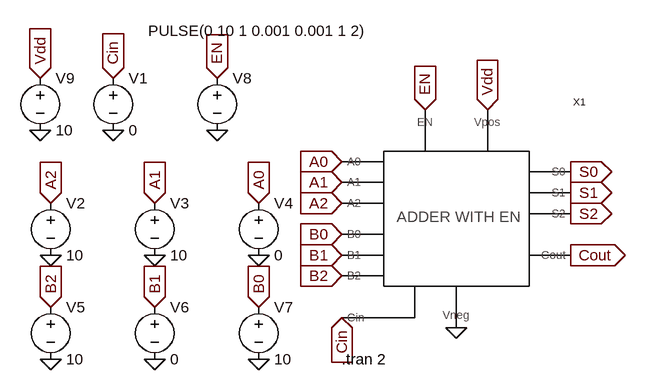
[diagram p0: schematic ADDER_EN_TESTING.asc]
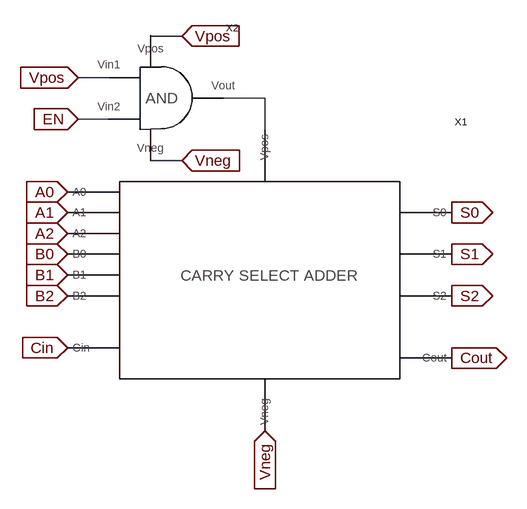
[diagram p1: sub-circuit adder_en_sym.asc]
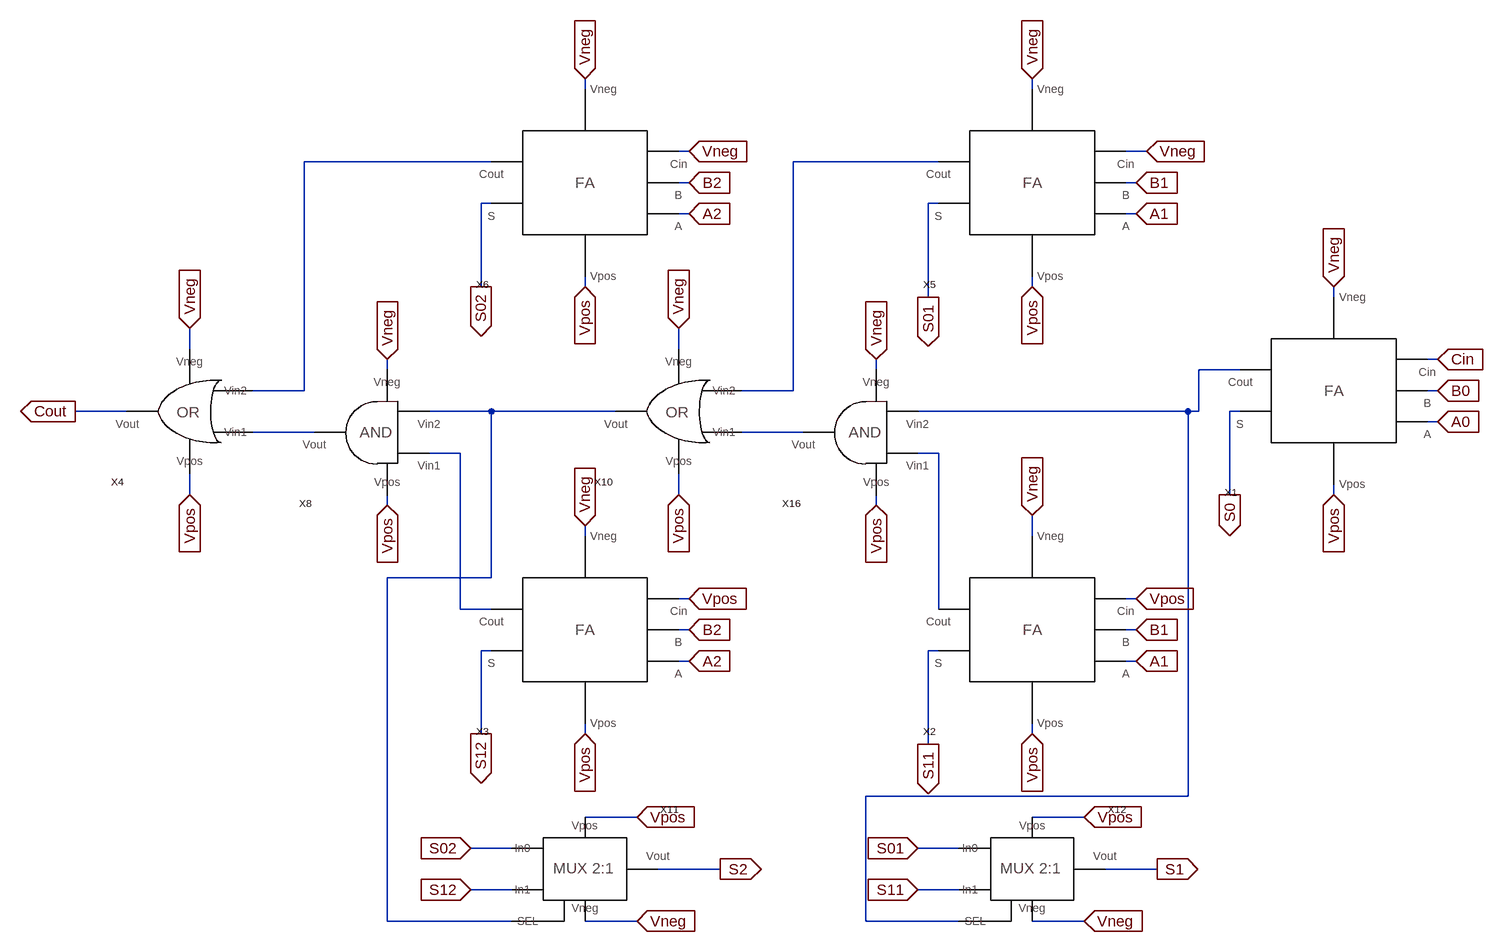
[diagram p2: sub-circuit carry_select_adder_sym.asc]
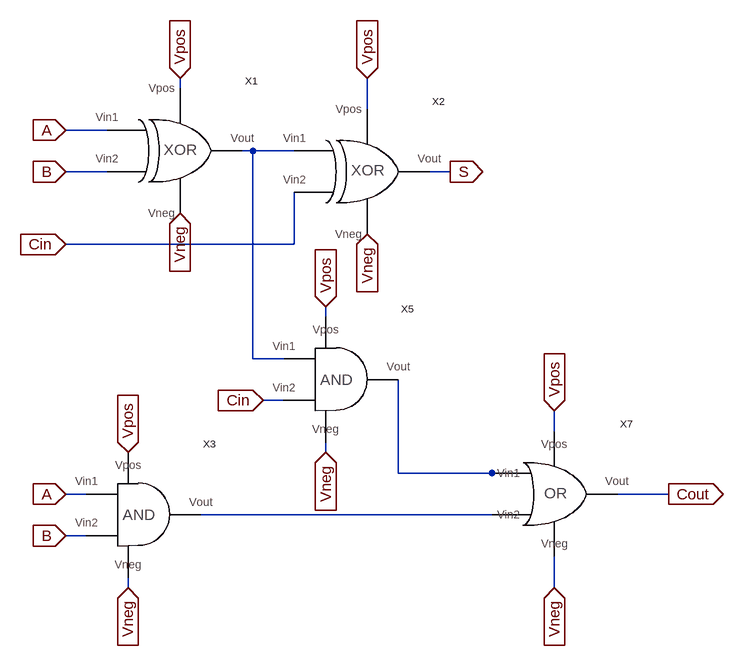
[diagram p3: sub-circuit full_adder_sym.asc]
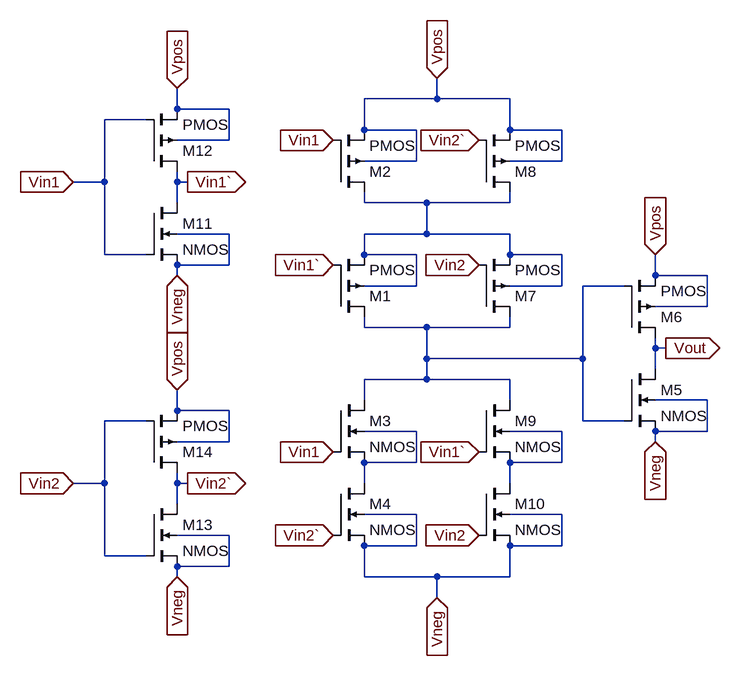
[diagram p4: sub-circuit xor_sym.asc]
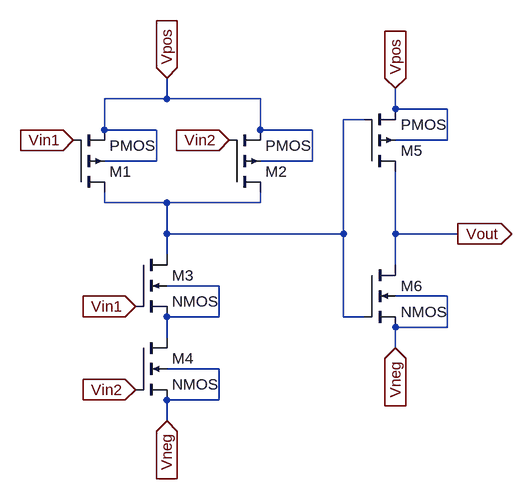
[diagram p5: sub-circuit and_sym.asc]
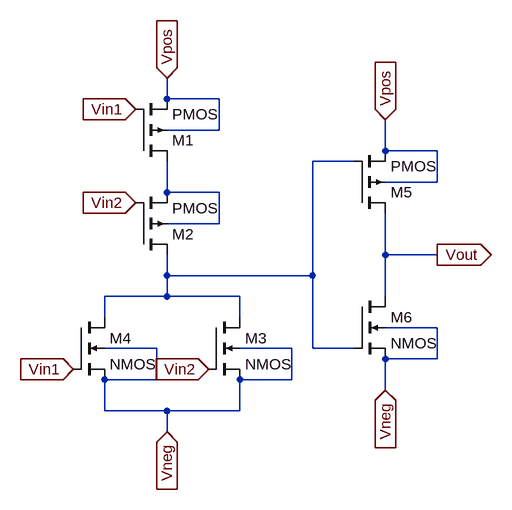
[diagram p6: sub-circuit or_sym.asc]
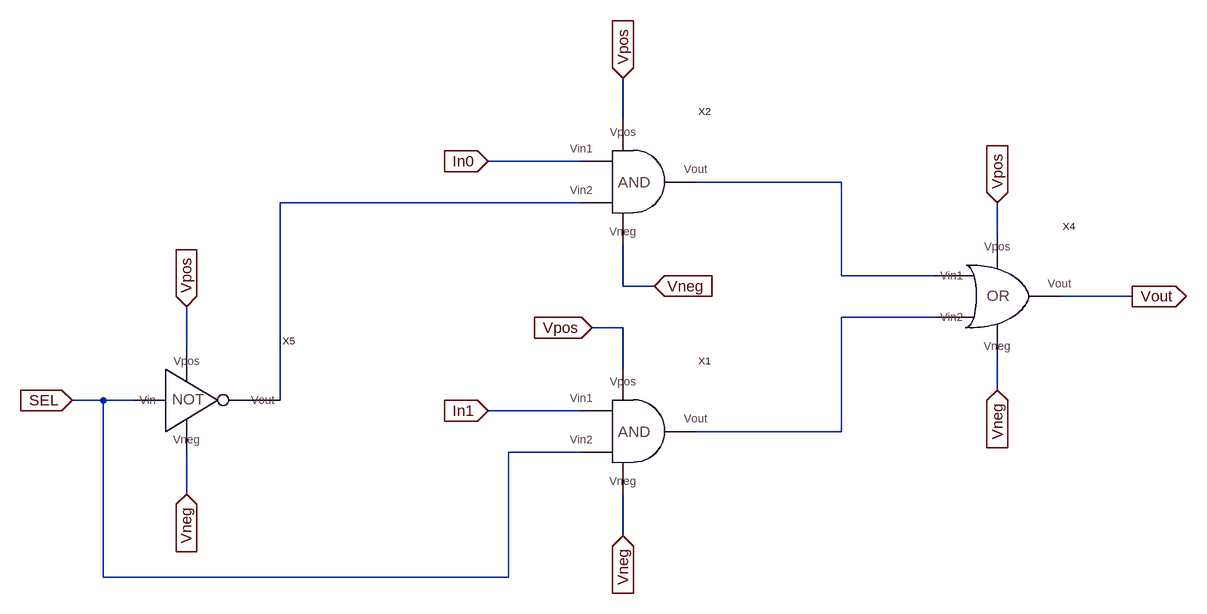
[diagram p7: sub-circuit mux2_1.asc]
ADDER_EN_TESTING.asc, the LTspice schematic file:
Version 4
SHEET 1 880 680
FLAG 160 96 A0
IOPIN 160 96 In
FLAG 160 128 A1
IOPIN 160 128 In
FLAG 160 160 A2
IOPIN 160 160 In
FLAG 160 208 B0
IOPIN 160 208 In
FLAG 160 240 B1
IOPIN 160 240 In
FLAG 160 272 B2
IOPIN 160 272 In
FLAG 288 16 EN
IOPIN 288 16 In
FLAG 384 16 Vdd
IOPIN 384 16 In
FLAG 336 352 0
FLAG -192 48 0
FLAG -32 48 0
FLAG -288 240 0
FLAG -128 240 0
FLAG 32 240 0
FLAG -288 400 0
FLAG -128 400 0
FLAG 32 400 0
FLAG -192 -32 Cin
IOPIN -192 -32 In
FLAG -32 -32 EN
IOPIN -32 -32 In
FLAG 32 160 A0
IOPIN 32 160 In
FLAG -128 160 A1
IOPIN -128 160 In
FLAG -288 160 A2
IOPIN -288 160 In
FLAG 32 320 B0
IOPIN 32 320 In
FLAG -128 320 B1
IOPIN -128 320 In
FLAG -288 320 B2
IOPIN -288 320 In
FLAG 512 112 S0
IOPIN 512 112 Out
FLAG 512 144 S1
IOPIN 512 144 Out
FLAG 512 176 S2
IOPIN 512 176 Out
FLAG 512 240 Cout
IOPIN 512 240 Out
FLAG -304 48 0
FLAG -304 -32 Vdd
IOPIN -304 -32 In
FLAG 160 336 Cin
IOPIN 160 336 In
SYMBOL ADDER_EN_SYM 336 176 R0
SYMATTR InstName X1
SYMBOL voltage -192 -48 R0
WINDOW 123 0 0 Left 0
WINDOW 39 0 0 Left 0
SYMATTR InstName V1
SYMATTR Value 0
SYMBOL voltage -288 144 R0
WINDOW 123 0 0 Left 0
WINDOW 39 0 0 Left 0
SYMATTR InstName V2
SYMATTR Value 10
SYMBOL voltage -128 144 R0
WINDOW 123 0 0 Left 0
WINDOW 39 0 0 Left 0
SYMATTR InstName V3
SYMATTR Value 10
SYMBOL voltage 32 144 R0
WINDOW 123 0 0 Left 0
WINDOW 39 0 0 Left 0
SYMATTR InstName V4
SYMATTR Value 0
SYMBOL voltage -288 304 R0
WINDOW 123 0 0 Left 0
WINDOW 39 0 0 Left 0
SYMATTR InstName V5
SYMATTR Value 10
SYMBOL voltage -128 304 R0
WINDOW 123 0 0 Left 0
WINDOW 39 0 0 Left 0
SYMATTR InstName V6
SYMATTR Value 0
SYMBOL voltage 32 304 R0
WINDOW 123 0 0 Left 0
WINDOW 39 0 0 Left 0
SYMATTR InstName V7
SYMATTR Value 10
SYMBOL voltage -32 -48 R0
WINDOW 3 -106 -57 Left 2
WINDOW 123 0 0 Left 0
WINDOW 39 0 0 Left 0
SYMATTR Value PULSE(0 10 1 0.001 0.001 1 2)
SYMATTR InstName V8
SYMBOL voltage -304 -48 R0
WINDOW 123 0 0 Left 0
WINDOW 39 0 0 Left 0
SYMATTR InstName V9
SYMATTR Value 10
TEXT 160 400 Left 2 !.tran 2

adder_en_sym.asc, the sub-circuit schematic file:
Version 4
SHEET 1 880 680
WIRE 112 -160 64 -160
WIRE 0 -96 -48 -96
WIRE 240 -64 176 -64
WIRE 0 -32 -48 -32
WIRE 240 -16 240 -64
WIRE 112 32 64 32
FLAG -64 80 A0
IOPIN -64 80 In
FLAG -64 112 A1
IOPIN -64 112 In
FLAG -64 144 A2
IOPIN -64 144 In
FLAG -64 176 B0
IOPIN -64 176 In
FLAG -64 208 B1
IOPIN -64 208 In
FLAG -64 240 B2
IOPIN -64 240 In
FLAG 240 448 Vneg
IOPIN 240 448 In
FLAG 528 112 S0
IOPIN 528 112 Out
FLAG 528 176 S1
IOPIN 528 176 Out
FLAG 528 240 S2
IOPIN 528 240 Out
FLAG 528 336 Cout
IOPIN 528 336 Out
FLAG -48 -96 Vpos
IOPIN -48 -96 In
FLAG -48 -32 EN
IOPIN -48 -32 In
FLAG 112 -160 Vpos
IOPIN 112 -160 In
FLAG 112 32 Vneg
IOPIN 112 32 In
FLAG -64 320 Cin
IOPIN -64 320 In
SYMBOL CARRY_SELECT_ADDER_SYM 240 208 R0
SYMATTR InstName X1
SYMBOL AND_SYM 80 -64 R0
SYMATTR InstName X2

carry_select_adder_sym.asc, the sub-circuit schematic file:
Version 4
SHEET 1 1472 884
WIRE -400 -688 -400 -704
WIRE 288 -688 288 -704
WIRE -240 -592 -256 -592
WIRE 464 -592 432 -592
WIRE -544 -576 -832 -576
WIRE 144 -576 -80 -576
WIRE -240 -544 -256 -544
WIRE 448 -544 432 -544
WIRE -544 -512 -560 -512
WIRE 144 -512 128 -512
WIRE -240 -496 -256 -496
WIRE 448 -496 432 -496
WIRE -560 -384 -560 -512
WIRE -400 -384 -400 -400
WIRE 288 -384 288 -400
WIRE 128 -368 128 -512
WIRE 752 -368 752 -384
WIRE -1008 -288 -1008 -320
WIRE -256 -288 -256 -320
WIRE 912 -272 896 -272
WIRE -704 -256 -704 -272
WIRE 48 -256 48 -272
WIRE 608 -256 544 -256
WIRE -832 -224 -832 -576
WIRE -832 -224 -912 -224
WIRE -80 -224 -80 -576
WIRE -80 -224 -160 -224
WIRE 912 -224 896 -224
WIRE -1104 -192 -1184 -192
WIRE -544 -192 -640 -192
WIRE -352 -192 -544 -192
WIRE 528 -192 112 -192
WIRE 544 -192 544 -256
WIRE 544 -192 528 -192
WIRE 608 -192 592 -192
WIRE 912 -176 896 -176
WIRE -816 -160 -912 -160
WIRE -64 -160 -160 -160
WIRE -592 -128 -640 -128
WIRE 144 -128 112 -128
WIRE -1008 -64 -1008 -96
WIRE -256 -64 -256 -96
WIRE 592 -64 592 -192
WIRE 752 -64 752 -80
WIRE -704 -48 -704 -64
WIRE 48 -48 48 -64
WIRE -400 0 -400 -16
WIRE 288 0 288 -32
WIRE -544 64 -544 -192
WIRE -544 64 -704 64
WIRE -240 96 -256 96
WIRE 448 96 432 96
WIRE -592 112 -592 -128
WIRE -544 112 -592 112
WIRE 144 112 144 -128
WIRE -240 144 -256 144
WIRE 448 144 432 144
WIRE -544 176 -560 176
WIRE 144 176 128 176
WIRE -240 192 -256 192
WIRE 448 192 432 192
WIRE -560 304 -560 176
WIRE -400 304 -400 288
WIRE 288 304 288 288
WIRE 128 320 128 176
WIRE 528 400 528 -192
WIRE 528 400 32 400
WIRE -320 432 -400 432
WIRE 368 432 288 432
WIRE -512 480 -576 480
WIRE 176 480 112 480
WIRE -192 512 -288 512
WIRE 480 512 400 512
WIRE -512 544 -576 544
WIRE 176 544 112 544
WIRE -704 592 -704 64
WIRE -512 592 -704 592
WIRE -320 592 -400 592
WIRE 32 592 32 400
WIRE 176 592 32 592
WIRE 368 592 288 592
FLAG 912 -176 A0
IOPIN 912 -176 In
FLAG 448 192 A1
IOPIN 448 192 In
FLAG -240 192 A2
IOPIN -240 192 In
FLAG 912 -224 B0
IOPIN 912 -224 In
FLAG 448 144 B1
IOPIN 448 144 In
FLAG -240 144 B2
IOPIN -240 144 In
FLAG -400 304 Vpos
IOPIN -400 304 In
FLAG 288 304 Vpos
IOPIN 288 304 In
FLAG 752 -64 Vpos
IOPIN 752 -64 In
FLAG 592 -64 S0
IOPIN 592 -64 Out
FLAG 128 320 S11
IOPIN 128 320 Out
FLAG -560 304 S12
IOPIN -560 304 Out
FLAG 448 -496 A1
IOPIN 448 -496 In
FLAG -240 -496 A2
IOPIN -240 -496 In
FLAG 448 -544 B1
IOPIN 448 -544 In
FLAG -240 -544 B2
IOPIN -240 -544 In
FLAG 288 -384 Vpos
IOPIN 288 -384 In
FLAG 288 -704 Vneg
IOPIN 288 -704 In
FLAG -400 -704 Vneg
IOPIN -400 -704 In
FLAG 128 -368 S01
IOPIN 128 -368 Out
FLAG -560 -384 S02
IOPIN -560 -384 Out
FLAG -400 -384 Vpos
IOPIN -400 -384 In
FLAG 752 -384 Vneg
IOPIN 752 -384 In
FLAG 288 -32 Vneg
IOPIN 288 -32 In
FLAG -400 -16 Vneg
IOPIN -400 -16 In
FLAG -1008 -64 Vpos
IOPIN -1008 -64 In
FLAG -1008 -320 Vneg
IOPIN -1008 -320 In
FLAG -704 -48 Vpos
IOPIN -704 -48 In
FLAG -704 -272 Vneg
IOPIN -704 -272 In
FLAG -256 -320 Vneg
IOPIN -256 -320 In
FLAG 48 -272 Vneg
IOPIN 48 -272 In
FLAG -256 -64 Vpos
IOPIN -256 -64 In
FLAG 48 -48 Vpos
IOPIN 48 -48 In
FLAG -320 432 Vpos
IOPIN -320 432 In
FLAG 368 432 Vpos
IOPIN 368 432 In
FLAG -320 592 Vneg
IOPIN -320 592 In
FLAG 368 592 Vneg
IOPIN 368 592 In
FLAG -576 480 S02
IOPIN -576 480 In
FLAG -576 544 S12
IOPIN -576 544 In
FLAG 112 480 S01
IOPIN 112 480 In
FLAG 112 544 S11
IOPIN 112 544 In
FLAG -192 512 S2
IOPIN -192 512 Out
FLAG 480 512 S1
IOPIN 480 512 Out
FLAG -1184 -192 Cout
IOPIN -1184 -192 Out
FLAG 464 -592 Vneg
IOPIN 464 -592 In
FLAG -240 -592 Vneg
IOPIN -240 -592 In
FLAG -240 96 Vpos
IOPIN -240 96 In
FLAG 448 96 Vpos
IOPIN 448 96 In
FLAG 912 -272 Cin
IOPIN 912 -272 In
SYMBOL FULL_ADDER_SYM 752 -224 R180
SYMATTR InstName X1
SYMBOL FULL_ADDER_SYM 288 144 R180
SYMATTR InstName X2
SYMBOL FULL_ADDER_SYM -400 144 R180
SYMATTR InstName X3
SYMBOL FULL_ADDER_SYM 288 -544 R180
SYMATTR InstName X5
SYMBOL FULL_ADDER_SYM -400 -544 R180
SYMATTR InstName X6
SYMBOL OR_SYM -272 -192 R180
SYMATTR InstName X10
SYMBOL MUX2_1 -400 512 R0
SYMATTR InstName X11
SYMBOL MUX2_1 288 512 R0
SYMATTR InstName X12
SYMBOL AND_SYM 32 -160 R180
SYMATTR InstName X16
SYMBOL OR_SYM -1024 -192 R180
SYMATTR InstName X4
SYMBOL AND_SYM -720 -160 R180
SYMATTR InstName X8

full_adder_sym.asc, the sub-circuit schematic file:
Version 4
SHEET 1 1280 1092
WIRE 256 48 256 32
WIRE 544 80 544 32
WIRE 144 112 80 112
WIRE 368 144 352 144
WIRE 432 144 368 144
WIRE 144 176 80 176
WIRE 672 176 640 176
WIRE 432 288 432 208
WIRE 432 288 80 288
WIRE 480 400 480 384
WIRE 368 464 368 144
WIRE 416 464 368 464
WIRE 416 528 384 528
WIRE 832 576 832 544
WIRE 480 608 480 592
WIRE 176 624 176 608
WIRE 592 640 592 496
WIRE 736 640 592 640
WIRE 752 640 736 640
WIRE 112 672 80 672
WIRE 1008 672 928 672
WIRE 736 704 288 704
WIRE 112 736 80 736
WIRE 176 816 176 800
WIRE 832 816 832 768
FLAG 80 112 A
IOPIN 80 112 In
FLAG 80 176 B
IOPIN 80 176 In
FLAG 80 288 Cin
IOPIN 80 288 In
FLAG 256 32 Vpos
IOPIN 256 32 In
FLAG 256 240 Vneg
IOPIN 256 240 In
FLAG 544 32 Vpos
IOPIN 544 32 In
FLAG 544 272 Vneg
IOPIN 544 272 In
FLAG 80 672 A
IOPIN 80 672 In
FLAG 80 736 B
IOPIN 80 736 In
FLAG 384 528 Cin
IOPIN 384 528 In
FLAG 176 608 Vpos
IOPIN 176 608 In
FLAG 480 384 Vpos
IOPIN 480 384 In
FLAG 832 544 Vpos
IOPIN 832 544 In
FLAG 672 176 S
IOPIN 672 176 Out
FLAG 1008 672 Cout
IOPIN 1008 672 Out
FLAG 176 816 Vneg
IOPIN 176 816 In
FLAG 480 608 Vneg
IOPIN 480 608 In
FLAG 832 816 Vneg
IOPIN 832 816 In
SYMBOL XOR_SYM 256 144 R0
SYMATTR InstName X1
SYMBOL XOR_SYM 544 176 R0
SYMATTR InstName X2
SYMBOL AND_SYM 192 704 R0
SYMATTR InstName X3
SYMBOL AND_SYM 496 496 R0
SYMATTR InstName X5
SYMBOL OR_SYM 848 672 R0
SYMATTR InstName X7

xor_sym.asc, the sub-circuit schematic file:
Version 4
SHEET 1 880 772
WIRE 144 -144 144 -176
WIRE 144 -144 32 -144
WIRE 256 -144 144 -144
WIRE -256 -128 -256 -160
WIRE -176 -128 -256 -128
WIRE -304 -112 -368 -112
WIRE 32 -96 32 -144
WIRE 112 -96 32 -96
WIRE 256 -96 256 -144
WIRE 336 -96 256 -96
WIRE -176 -80 -176 -128
WIRE -176 -80 -256 -80
WIRE 112 -48 112 -96
WIRE 112 -48 32 -48
WIRE 336 -48 336 -96
WIRE 336 -48 256 -48
WIRE -368 -16 -368 -112
WIRE -368 -16 -416 -16
WIRE -256 -16 -256 -32
WIRE -240 -16 -256 -16
WIRE -256 16 -256 -16
WIRE 32 16 32 0
WIRE 128 16 32 16
WIRE 256 16 256 0
WIRE 256 16 128 16
WIRE -176 64 -256 64
WIRE 128 64 128 16
WIRE 128 64 32 64
WIRE 256 64 128 64
WIRE -368 96 -368 -16
WIRE -304 96 -368 96
WIRE 32 96 32 64
WIRE 112 96 32 96
WIRE 256 96 256 64
WIRE 336 96 256 96
WIRE -176 112 -176 64
WIRE -176 112 -256 112
WIRE -256 128 -256 112
WIRE 480 128 480 96
WIRE 560 128 480 128
WIRE 112 144 112 96
WIRE 112 144 32 144
WIRE 336 144 336 96
WIRE 336 144 256 144
WIRE 432 144 368 144
WIRE 560 176 560 128
WIRE 560 176 480 176
WIRE 32 208 32 192
WIRE 128 208 32 208
WIRE 256 208 256 192
WIRE 256 208 128 208
WIRE 480 240 480 224
WIRE 496 240 480 240
WIRE 128 256 128 208
WIRE 368 256 368 144
WIRE 368 256 128 256
WIRE 480 272 480 240
WIRE 128 288 128 256
WIRE 128 288 32 288
WIRE 256 288 128 288
WIRE 32 320 32 288
WIRE 256 320 256 288
WIRE 560 320 480 320
WIRE -256 336 -256 304
WIRE -176 336 -256 336
WIRE -304 352 -368 352
WIRE 368 352 368 256
WIRE 432 352 368 352
WIRE 112 368 32 368
WIRE 336 368 256 368
WIRE 560 368 560 320
WIRE 560 368 480 368
WIRE -176 384 -176 336
WIRE -176 384 -256 384
WIRE 480 384 480 368
WIRE 112 416 112 368
WIRE 112 416 32 416
WIRE 336 416 336 368
WIRE 336 416 256 416
WIRE -368 448 -368 352
WIRE -368 448 -416 448
WIRE -256 448 -256 432
WIRE -240 448 -256 448
WIRE 32 448 32 416
WIRE 256 448 256 416
WIRE -256 480 -256 448
WIRE 112 496 32 496
WIRE 336 496 256 496
WIRE -176 528 -256 528
WIRE 112 544 112 496
WIRE 112 544 32 544
WIRE 336 544 336 496
WIRE 336 544 256 544
WIRE -368 560 -368 448
WIRE -304 560 -368 560
WIRE -176 576 -176 528
WIRE -176 576 -256 576
WIRE -256 592 -256 576
WIRE 32 592 32 544
WIRE 144 592 32 592
WIRE 256 592 256 544
WIRE 256 592 144 592
WIRE 144 624 144 592
FLAG 144 -176 Vpos
IOPIN 144 -176 In
FLAG -416 -16 Vin1
IOPIN -416 -16 In
FLAG -16 400 Vin1
IOPIN -16 400 In
FLAG -416 448 Vin2
IOPIN -416 448 In
FLAG 144 624 Vneg
IOPIN 144 624 In
FLAG 480 96 Vpos
IOPIN 480 96 In
FLAG 480 384 Vneg
IOPIN 480 384 In
FLAG 496 240 Vout
IOPIN 496 240 Out
FLAG -16 -80 Vin1
IOPIN -16 -80 In
FLAG -256 -160 Vpos
IOPIN -256 -160 In
FLAG -256 128 Vneg
IOPIN -256 128 In
FLAG -240 -16 Vin1`
IOPIN -240 -16 Out
FLAG -256 304 Vpos
IOPIN -256 304 In
FLAG -256 592 Vneg
IOPIN -256 592 In
FLAG -240 448 Vin2`
IOPIN -240 448 Out
FLAG 208 112 Vin2
IOPIN 208 112 In
FLAG 208 -80 Vin2`
IOPIN 208 -80 In
FLAG -16 112 Vin1`
IOPIN -16 112 In
FLAG 208 400 Vin1`
IOPIN 208 400 In
FLAG -16 528 Vin2`
IOPIN -16 528 In
FLAG 208 528 Vin2
IOPIN 208 528 In
SYMBOL pmos4 -16 192 M180
SYMATTR InstName M1
SYMBOL pmos4 -16 0 M180
SYMATTR InstName M2
SYMBOL nmos4 -16 320 R0
SYMATTR InstName M3
SYMBOL nmos4 -16 448 R0
SYMATTR InstName M4
SYMBOL nmos4 432 272 R0
SYMATTR InstName M5
SYMBOL pmos4 432 224 M180
SYMATTR InstName M6
SYMBOL pmos4 208 192 M180
SYMATTR InstName M7
SYMBOL pmos4 208 0 M180
SYMATTR InstName M8
SYMBOL nmos4 208 320 R0
SYMATTR InstName M9
SYMBOL nmos4 208 448 R0
SYMATTR InstName M10
SYMBOL nmos4 -304 16 R0
SYMATTR InstName M11
SYMBOL pmos4 -304 -32 M180
SYMATTR InstName M12
SYMBOL nmos4 -304 480 R0
SYMATTR InstName M13
SYMBOL pmos4 -304 432 M180
SYMATTR InstName M14

and_sym.asc, the sub-circuit schematic file:
Version 4
SHEET 1 880 680
WIRE 272 -16 272 -48
WIRE 272 -16 176 -16
WIRE 416 -16 272 -16
WIRE 624 0 624 -32
WIRE 704 0 624 0
WIRE 576 16 544 16
WIRE 176 32 176 -16
WIRE 256 32 176 32
WIRE 416 32 416 -16
WIRE 496 32 416 32
WIRE 704 48 704 0
WIRE 704 48 624 48
WIRE 256 80 256 32
WIRE 256 80 176 80
WIRE 496 80 496 32
WIRE 496 80 416 80
WIRE 176 144 176 128
WIRE 272 144 176 144
WIRE 416 144 416 128
WIRE 416 144 272 144
WIRE 272 192 272 144
WIRE 544 192 544 16
WIRE 544 192 272 192
WIRE 624 192 624 96
WIRE 720 192 624 192
WIRE 272 224 272 192
WIRE 624 240 624 192
WIRE 352 272 272 272
WIRE 704 288 624 288
WIRE 352 320 352 272
WIRE 352 320 272 320
WIRE 544 320 544 192
WIRE 576 320 544 320
WIRE 704 336 704 288
WIRE 704 336 624 336
WIRE 272 352 272 320
WIRE 624 368 624 336
WIRE 352 400 272 400
WIRE 352 448 352 400
WIRE 352 448 272 448
WIRE 272 480 272 448
FLAG 272 -48 Vpos
IOPIN 272 -48 In
FLAG 128 48 Vin1
IOPIN 128 48 In
FLAG 224 304 Vin1
IOPIN 224 304 In
FLAG 224 432 Vin2
IOPIN 224 432 In
FLAG 720 192 Vout
IOPIN 720 192 Out
FLAG 368 48 Vin2
IOPIN 368 48 In
FLAG 272 480 Vneg
IOPIN 272 480 In
FLAG 624 -32 Vpos
IOPIN 624 -32 In
FLAG 624 368 Vneg
IOPIN 624 368 In
SYMBOL pmos4 128 128 M180
SYMATTR InstName M1
SYMBOL pmos4 368 128 M180
SYMATTR InstName M2
SYMBOL nmos4 224 224 R0
SYMATTR InstName M3
SYMBOL nmos4 224 352 R0
SYMATTR InstName M4
SYMBOL pmos4 576 96 M180
SYMATTR InstName M5
SYMBOL nmos4 576 240 R0
SYMATTR InstName M6

or_sym.asc, the sub-circuit schematic file:
Version 4
SHEET 1 880 680
WIRE 128 -128 128 -160
WIRE 208 -128 128 -128
WIRE 208 -80 208 -128
WIRE 208 -80 128 -80
WIRE 464 -48 464 -96
WIRE 544 -48 464 -48
WIRE 416 -32 352 -32
WIRE 544 0 544 -48
WIRE 544 0 464 0
WIRE 128 16 128 -32
WIRE 208 16 128 16
WIRE 208 64 208 16
WIRE 208 64 128 64
WIRE 464 112 464 48
WIRE 544 112 464 112
WIRE 128 144 128 112
WIRE 352 144 352 -32
WIRE 352 144 128 144
WIRE 128 176 128 144
WIRE 128 176 32 176
WIRE 240 176 128 176
WIRE 464 176 464 112
WIRE 32 208 32 176
WIRE 240 208 240 176
WIRE 544 224 464 224
WIRE 112 256 32 256
WIRE 320 256 240 256
WIRE 352 256 352 144
WIRE 416 256 352 256
WIRE 544 272 544 224
WIRE 544 272 464 272
WIRE 112 304 112 256
WIRE 112 304 32 304
WIRE 320 304 320 256
WIRE 320 304 240 304
WIRE 464 320 464 272
WIRE 32 352 32 304
WIRE 128 352 32 352
WIRE 240 352 240 304
WIRE 240 352 128 352
WIRE 128 384 128 352
FLAG 128 -160 Vpos
IOPIN 128 -160 In
FLAG 128 384 Vneg
IOPIN 128 384 In
FLAG -16 288 Vin1
IOPIN -16 288 In
FLAG 192 288 Vin2
IOPIN 192 288 In
FLAG 80 -112 Vin1
IOPIN 80 -112 In
FLAG 80 32 Vin2
IOPIN 80 32 In
FLAG 544 112 Vout
IOPIN 544 112 Out
FLAG 464 -96 Vpos
IOPIN 464 -96 In
FLAG 464 320 Vneg
IOPIN 464 320 In
SYMBOL pmos4 80 -32 M180
SYMATTR InstName M1
SYMBOL pmos4 80 112 M180
SYMATTR InstName M2
SYMBOL nmos4 192 208 R0
SYMATTR InstName M3
SYMBOL nmos4 -16 208 R0
SYMATTR InstName M4
SYMBOL pmos4 416 48 M180
SYMATTR InstName M5
SYMBOL nmos4 416 176 R0
SYMATTR InstName M6

mux2_1.asc, the sub-circuit schematic file:
Version 4
SHEET 1 1072 680
WIRE 176 -352 176 -416
WIRE 112 -288 -32 -288
WIRE 512 -256 288 -256
WIRE 112 -224 -352 -224
WIRE 752 -176 752 -224
WIRE 512 -112 512 -256
WIRE 656 -112 512 -112
WIRE 176 -96 176 -160
WIRE 224 -96 176 -96
WIRE 960 -80 848 -80
WIRE 656 -48 512 -48
WIRE 176 -32 128 -32
WIRE -496 0 -496 -64
WIRE 176 32 176 -32
WIRE 752 64 752 16
WIRE -624 80 -672 80
WIRE -576 80 -624 80
WIRE -352 80 -352 -224
WIRE 112 96 -32 96
WIRE 512 128 512 -48
WIRE 512 128 288 128
WIRE 112 160 0 160
WIRE -496 224 -496 160
WIRE 176 288 176 224
WIRE -624 352 -624 80
WIRE 0 352 0 160
WIRE 0 352 -624 352
FLAG -32 -288 In0
IOPIN -32 -288 In
FLAG -32 96 In1
IOPIN -32 96 In
FLAG -672 80 SEL
IOPIN -672 80 In
FLAG 176 -416 Vpos
IOPIN 176 -416 In
FLAG 224 -96 Vneg
IOPIN 224 -96 In
FLAG 128 -32 Vpos
IOPIN 128 -32 In
FLAG 752 -224 Vpos
IOPIN 752 -224 In
FLAG 752 64 Vneg
IOPIN 752 64 In
FLAG 176 288 Vneg
IOPIN 176 288 In
FLAG -496 -64 Vpos
IOPIN -496 -64 In
FLAG -496 224 Vneg
IOPIN -496 224 In
FLAG 960 -80 Vout
IOPIN 960 -80 Out
SYMBOL AND_SYM 192 128 R0
SYMATTR InstName X1
SYMBOL AND_SYM 192 -256 R0
SYMATTR InstName X2
SYMBOL OR_SYM 768 -80 R0
SYMATTR InstName X4
SYMBOL NOT_SYM -496 80 R0
SYMATTR InstName X5

The netlist it stands for:
* ADDER_EN_TESTING.asc
XX1 A0 A1 A2 B0 B1 B2 Vdd EN 0 S0 S1 S2 Cout Cin adder_en_sym
V1 Cin 0 0
V2 A2 0 10
V3 A1 0 10
V4 A0 0 0
V5 B2 0 10
V6 B1 0 0
V7 B0 0 10
V8 EN 0 PULSE(0 10 1 0.001 0.001 1 2)
V9 Vdd 0 10

* block symbol definitions
.subckt adder_en_sym A0 A1 A2 B0 B1 B2 Vpos EN Vneg S0 S1 S2 Cout Cin
XX1 A0 A1 A2 B0 B1 B2 Cout N001 Vneg S0 S1 S2 Cin carry_select_adder_sym
XX2 Vpos EN Vpos Vneg N001 and_sym
.ends adder_en_sym

.subckt carry_select_adder_sym A0 A1 A2 B0 B1 B2 Cout Vpos Vneg S0 S1 S2 Cin
XX1 A0 B0 Cin S0 N003 Vpos Vneg full_adder_sym
XX2 A1 B1 Vpos S11 N008 Vpos Vneg full_adder_sym
XX3 A2 B2 Vpos S12 N007 Vpos Vneg full_adder_sym
XX5 A1 B1 Vneg S01 N002 Vpos Vneg full_adder_sym
XX6 A2 B2 Vneg S02 N001 Vpos Vneg full_adder_sym
XX10 Vpos N006 N002 N004 Vneg or_sym
XX11 S02 S12 N004 Vpos Vneg S2 mux2_1
XX12 S01 S11 N003 Vpos Vneg S1 mux2_1
XX16 N008 N003 Vpos Vneg N006 and_sym
XX4 Vpos N005 N001 Cout Vneg or_sym
XX8 N007 N004 Vpos Vneg N005 and_sym
.ends carry_select_adder_sym

.subckt full_adder_sym A B Cin S Cout Vpos Vneg
XX1 A B Vpos N001 Vneg xor_sym
XX2 N001 Cin Vpos S Vneg xor_sym
XX3 A B Vpos Vneg N003 and_sym
XX5 N001 Cin Vpos Vneg N002 and_sym
XX7 Vpos N002 N003 Cout Vneg or_sym
.ends full_adder_sym

.subckt xor_sym Vin1 Vin2 Vpos Vout Vneg
M1 N002 Vin1` N001 N001 PMOS
M2 N001 Vin1 Vpos Vpos PMOS
M3 N002 Vin1 N003 N003 NMOS
M4 N003 Vin2` Vneg Vneg NMOS
M5 Vout N002 Vneg Vneg NMOS
M6 Vout N002 Vpos Vpos PMOS
M7 N002 Vin2 N001 N001 PMOS
M8 N001 Vin2` Vpos Vpos PMOS
M9 N002 Vin1` N004 N004 NMOS
M10 N004 Vin2 Vneg Vneg NMOS
M11 Vin1` Vin1 Vneg Vneg NMOS
M12 Vin1` Vin1 Vpos Vpos PMOS
M13 Vin2` Vin2 Vneg Vneg NMOS
M14 Vin2` Vin2 Vpos Vpos PMOS
.ends xor_sym

.subckt and_sym Vin1 Vin2 Vpos Vneg Vout
M1 N001 Vin1 Vpos Vpos PMOS
M2 N001 Vin2 Vpos Vpos PMOS
M3 N001 Vin1 N002 N002 NMOS
M4 N002 Vin2 Vneg Vneg NMOS
M5 Vout N001 Vpos Vpos PMOS
M6 Vout N001 Vneg Vneg NMOS
.ends and_sym

.subckt or_sym Vpos Vin1 Vin2 Vout Vneg
M1 N002 Vin1 Vpos Vpos PMOS
M2 N001 Vin2 N002 N002 PMOS
M3 N001 Vin2 Vneg Vneg NMOS
M4 N001 Vin1 Vneg Vneg NMOS
M5 Vout N001 Vpos Vpos PMOS
M6 Vout N001 Vneg Vneg NMOS
.ends or_sym

.subckt mux2_1 In0 In1 SEL Vpos Vneg Vout
XX1 In1 SEL Vpos Vneg N003 and_sym
XX2 In0 N002 Vpos Vneg N001 and_sym
XX4 Vpos N001 N003 Vout Vneg or_sym
XX5 SEL Vpos N002 Vneg NOT_SYM  ; pins Vin Vpos Vout Vneg
.ends mux2_1

.model NMOS NMOS
.model PMOS PMOS
.lib standard.mos
.tran 2
.backanno
.end

* Results of the author's LTspice run, read from the files saved beside the schematic
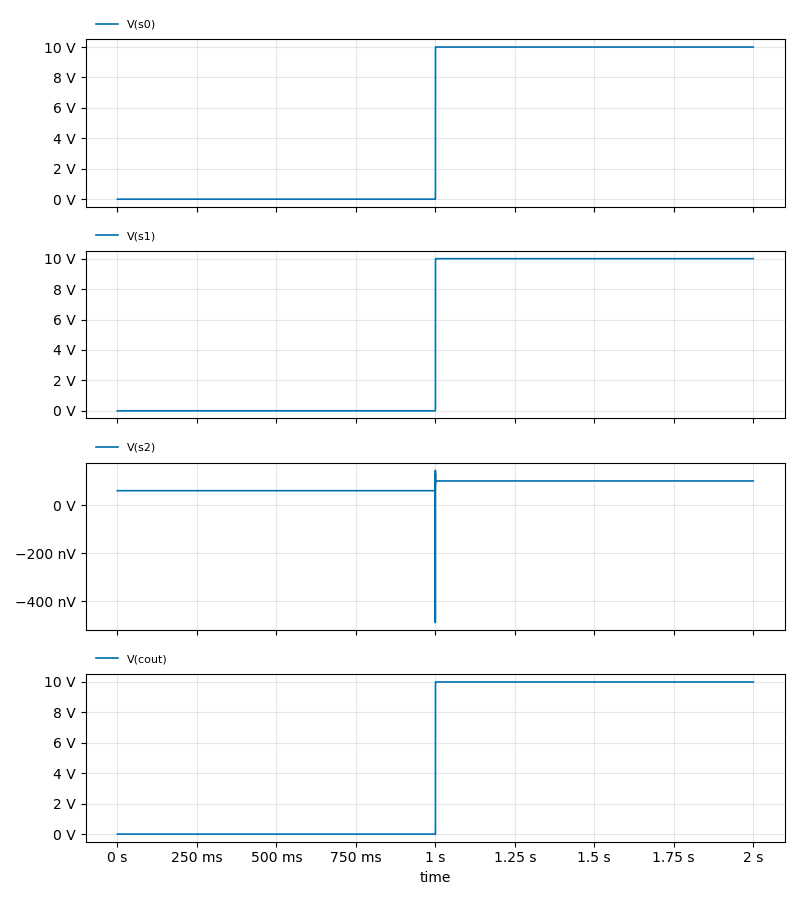
[diagram p8: Transient Analysis of ADDER_EN_TESTING.asc, plotted from the saved traces]
* Transient Analysis, 1 run:
*   V(s0): min 0 V, max 10 V, average 4.997 V, rms 7.069 V, last 10 V
*   V(s1): min 0 V, max 10 V, average 4.997 V, rms 7.069 V, last 10 V
*   V(s2): min -487.3 nV, max 144 nV, average 79.78 nV, rms 82.38 nV, last 100.1 nV
*   V(cout): min 0 V, max 10 V, average 4.997 V, rms 7.069 V, last 10 V